# EAGLE design Filter-PCB (EAGLE 7.7.0)
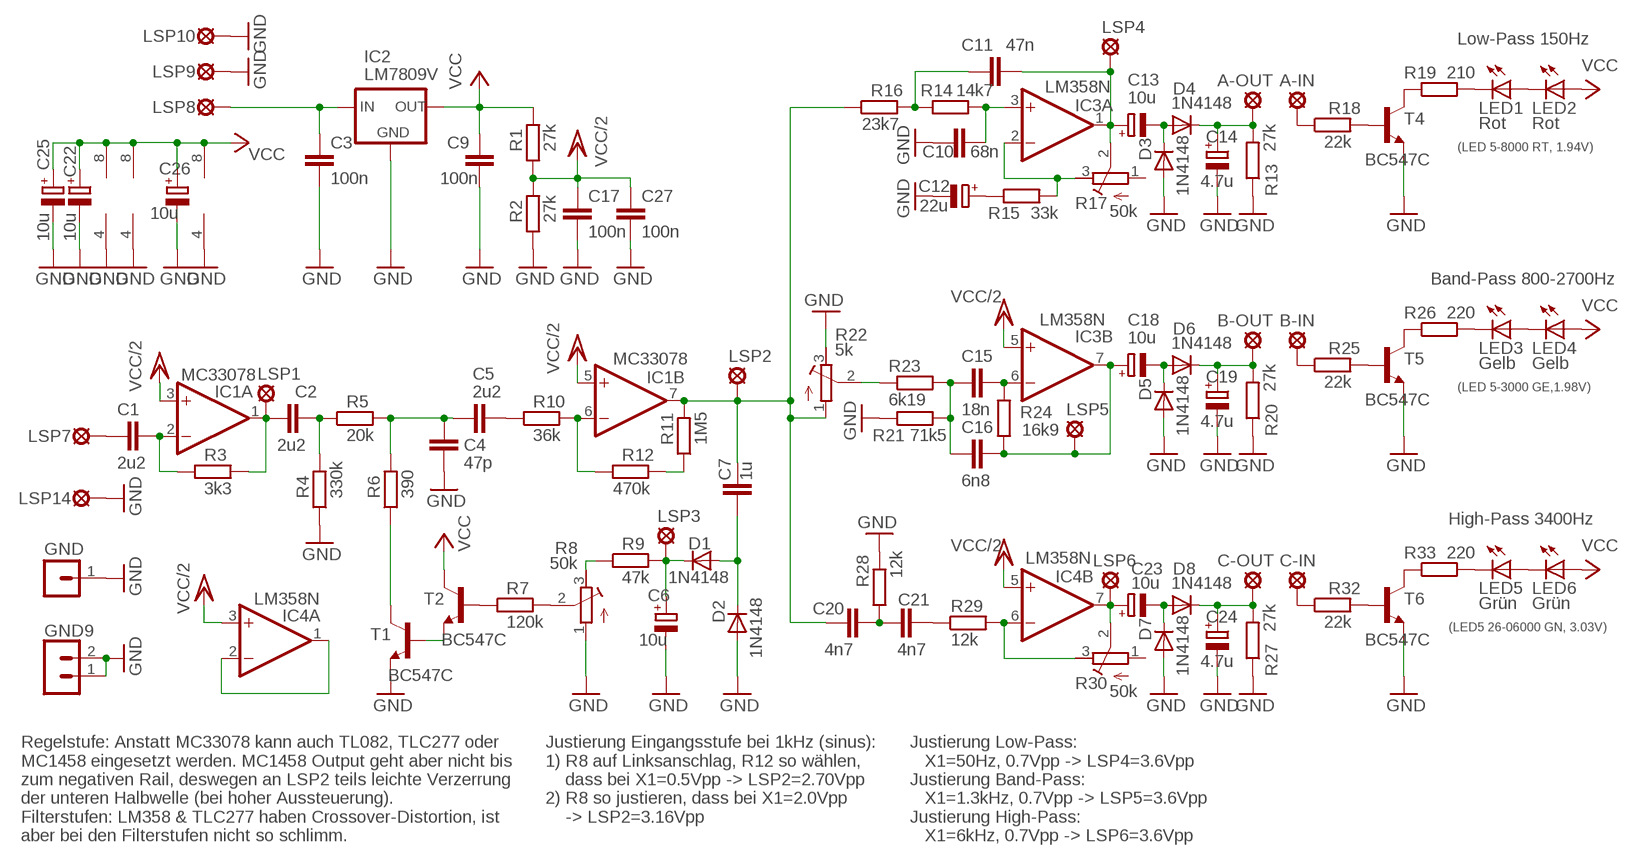
[diagram p0: schematic, sheet 1]

## Parts
A-IN  LSP13  [LSP13]
A-OUT  LSP13  [LSP13]
B-IN  LSP13  [LSP13]
B-OUT  LSP13  [LSP13]
C1  2u2  C-EUC1206  [C1206]
C2  2u2  C-EUC1206  [C1206]
C3  100n  C-EU050-024X044  [C050-024X044]
C4  47p  C-EUC1206  [C1206]
C5  2u2  C-EUC1206  [C1206]
C6  10u  CPOL-EUTT2D4  [TT2D4]
C7  1u  C-EU050-024X044  [C050-024X044]
C9  100n  C-EUC1206  [C1206]
C10  68n  C-EUC1206  [C1206]
C11  47n  C-EUC1206  [C1206]
C12  22u  CPOL-EUTT2D4  [TT2D4]
C13  10u  CPOL-EUTT2D4  [TT2D4]
C14  4.7u  CPOL-EUTT2D4  [TT2D4]
C15  18n  C-EUC1206  [C1206]
C16  6n8  C-EUC1206  [C1206]
C17  100n  C-EU050-024X044  [C050-024X044]
C18  10u  CPOL-EUTT2D4  [TT2D4]
C19  4.7u  CPOL-EUTT2D4  [TT2D4]
C20  4n7  C-EU050-024X044  [C050-024X044]
C21  4n7  C-EU050-024X044  [C050-024X044]
C22  10u  CPOL-EUTT2D4  [TT2D4]
C23  10u  CPOL-EUTT2D4  [TT2D4]
C24  4.7u  CPOL-EUTT2D4  [TT2D4]
C25  10u  CPOL-EUTT2D4  [TT2D4]
C26  10u  CPOL-EUTT2D4  [TT2D4]
C27  100n  C-EUC1206  [C1206]
C-IN  LSP13  [LSP13]
C-OUT  LSP13  [LSP13]
D1  1N4148  DIODE-SOD80C  [SOD80C]
D2  1N4148  DIODE-SOD80C  [SOD80C]
D3  1N4148  DIODE-SOD80C  [SOD80C]
D4  1N4148  DIODE-SOD80C  [SOD80C]
D5  1N4148  DIODE-SOD80C  [SOD80C]
D6  1N4148  DIODE-SOD80C  [SOD80C]
D7  1N4148  DIODE-SOD80C  [SOD80C]
D8  1N4148  DIODE-SOD80C  [SOD80C]
GND  MA01-1  [MA01-1]
GND9  MA02-1  [MA02-1]
IC1  MC33078  LM358N  [DIL08]
IC2  LM7809V  78XXS  [78XXS]
IC3  LM358N  [DIL08]
IC4  LM358N  [DIL08]
LED1  Rot  LED5MM  [LED5MM]
LED2  Rot  LED5MM  [LED5MM]
LED3  Gelb  LED5MM  [LED5MM]
LED4  Gelb  LED5MM  [LED5MM]
LED5  Grün  LED5MM  [LED5MM]
LED6  Grün  LED5MM  [LED5MM]
LSP1  LSP11  [LSP11]
LSP2  LSP11  [LSP11]
LSP3  LSP11  [LSP11]
LSP4  LSP11  [LSP11]
LSP5  LSP11  [LSP11]
LSP6  LSP11  [LSP11]
LSP7  LSP13  [LSP13]
LSP8  LSP13  [LSP13]
LSP9  LSP13  [LSP13]
LSP10  LSP13  [LSP13]
LSP14  LSP13  [LSP13]
R1  27k  R-EU_M1206  [M1206]
R2  27k  R-EU_M1206  [M1206]
R3  3k3  R-EU_M1206  [M1206]
R4  330k  R-EU_M1206  [M1206]
R5  20k  R-EU_M1206  [M1206]
R6  390  R-EU_M1206  [M1206]
R7  120k  R-EU_M1206  [M1206]
R8  50k  R-TRIMM64P  [RTRIM64P]
R9  47k  R-EU_M1206  [M1206]
R10  36k  R-EU_M1206  [M1206]
R11  1M5  R-EU_M1206  [M1206]
R12  470k  R-EU_0207/10  [0207/10]
R13  27k  R-EU_0207/10  [0207/10]
R14  14k7  R-EU_0207/10  [0207/10]
R15  33k  R-EU_M1206  [M1206]
R16  23k7  R-EU_0207/10  [0207/10]
R17  50k  R-TRIMM64P  [RTRIM64P]
R18  22k  R-EU_M1206  [M1206]
R19  210  R-EU_0207/10  [0207/10]
R20  27k  R-EU_0207/10  [0207/10]
R21  71k5  R-EU_0207/10  [0207/10]
R22  5k  R-TRIMM64P  [RTRIM64P]
R23  6k19  R-EU_0207/10  [0207/10]
R24  16k9  R-EU_0207/10  [0207/10]
R25  22k  R-EU_M1206  [M1206]
R26  220  R-EU_0207/10  [0207/10]
R27  27k  R-EU_0207/10  [0207/10]
R28  12k  R-EU_0207/10  [0207/10]
R29  12k  R-EU_0207/10  [0207/10]
R30  50k  R-TRIMM64P  [RTRIM64P]
R32  22k  R-EU_M1206  [M1206]
R33  220  R-EU_0207/10  [0207/10]
T1  BC547C  BC547  [TO92]
T2  BC547C  BC547  [TO92]
T4  BC547C  BC547  [TO92]
T5  BC547C  BC547  [TO92]
T6  BC547C  BC547  [TO92]

## Nets
GND: C3.2 C4.2 C6.- C9.1 C10.1 C12.- C14.- C17.2 C19.- C22.- C24.- C25.- C26.- C27.2 D2.A D3.A D5.A D7.A GND9.1 GND9.2 GND.1 IC1.4(P:V-) IC2.GND IC3.4(P:V-) IC4.4(P:V-) LSP9.MP LSP10.MP LSP14.MP R2.1 R4.1 R8.1(A) R13.1 R20.1 R21.1 R22.3(E) R27.1 R28.2 T1.1(E) T4.1(E) T5.1(E) T6.1(E)
N$1: R18.2 T4.2(B)
N$2: R25.2 T5.2(B)
N$3: R32.2 T6.2(B)
N$4: C1.2 IC1.2(A:-IN) R3.1
N$5: C2.2 R4.2 R5.1
N$6: R6.1 T1.3(C)
N$7: C2.1 IC1.1(A:OUT) LSP1.MP R3.2
N$8: C4.1 C5.1 R5.2 R6.2
N$9: R7.1 T2.2(B)
N$10: R7.2 R8.2(S)
N$11: T1.2(B) T2.1(E)
N$12: R8.3(E) R9.1
N$13: IC1.6(B:-IN) R10.2 R12.1
N$14: C7.1 C20.1 IC1.7(B:OUT) LSP2.MP R11.2 R16.1 R22.1(A)
N$15: C6.+ D1.C LSP3.MP R9.2
N$16: C7.2 D1.A D2.C
N$17 [Stromversorgung]: C3.1 IC2.IN LSP8.MP
N$18: C11.1 R14.1 R16.2
N$19: C5.2 R10.1
N$20: R11.1 R12.2
N$21: C10.2 IC3.3(A:+IN) R14.2
N$22: IC3.2(A:-IN) R15.2 R17.3(E)
N$23: C11.2 C13.+ IC3.1(A:OUT) LSP4.MP R17.2(S)
N$24: C12.+ R15.1
N$25: R22.2(S) R23.1
N$26: C13.- D3.C D4.A
N$27: A-OUT.MP C14.+ D4.C R13.2
N$28: C1.1 LSP7.MP
N$29: R19.1 T4.3(C)
N$30: LED1.K(C) R19.2
N$31: C24.+ C-OUT.MP D8.C R27.2
N$32: C15.1 C16.1 R21.2 R23.2
N$33: C15.2 IC3.6(B:-IN) R24.2
N$34: C21.2 R29.1
N$35: C16.2 C18.+ IC3.7(B:OUT) LSP5.MP R24.1
N$36: C20.2 C21.1 R28.1
N$37: C18.- D5.C D6.A
N$38: B-OUT.MP C19.+ D6.C R20.2
N$39: A-IN.MP R18.1
N$40: R26.1 T5.3(C)
N$41: LED3.K(C) R26.2
N$42: B-IN.MP R25.1
N$43: C23.+ IC4.7(B:OUT) LSP6.MP R30.2(S)
N$44: C-IN.MP R32.1
N$45: IC4.6(B:-IN) R29.2 R30.3(E)
N$46: C23.- D7.C D8.A
N$47: LED5.A LED6.K(C)
N$48: LED3.A LED4.K(C)
N$49: R33.1 T6.3(C)
N$50: LED5.K(C) R33.2
N$51: LED1.A LED2.K(C)
N$54: IC4.1(A:OUT) IC4.2(A:-IN)
VCC [Stromversorgung]: C9.2 C22.+ C25.+ C26.+ IC1.8(P:V+) IC2.OUT IC3.8(P:V+) IC4.8(P:V+) LED2.A LED4.A LED6.A R1.2 T2.3(C)
VCC/2: C17.1 C27.1 IC1.3(A:+IN) IC1.5(B:+IN) IC3.5(B:+IN) IC4.3(A:+IN) IC4.5(B:+IN) R1.1 R2.2
Unconnected: R17.1(A) R30.1(A)

## Notes on the sheet
- Low-Pass 150Hz
- (LED 5-8000 RT, 1.94V)
- Band-Pass 800-2700Hz
- (LED 5-3000 GE,1.98V)
- High-Pass 3400Hz
- (LED5 26-06000 GN, 3.03V)
- Regelstufe: Anstatt MC33078 kann auch TL082, TLC277 oder
  MC1458 eingesetzt werden. MC1458 Output geht aber nicht bis
  zum negativen Rail, deswegen an LSP2 teils leichte Verzerrung
  der unteren Halbwelle (bei hoher Aussteuerung).
  Filterstufen: LM358 & TLC277 haben Crossover-Distortion, ist
  aber bei den Filterstufen nicht so schlimm.
- Justierung Eingangsstufe bei 1kHz (sinus):
  1) R8 auf Linksanschlag, R12 so wählen,
      dass bei X1=0.5Vpp -> LSP2=2.70Vpp
  2) R8 so justieren, dass bei X1=2.0Vpp
      -> LSP2=3.16Vpp
- Justierung Low-Pass: 
     X1=50Hz, 0.7Vpp -> LSP4=3.6Vpp
  Justierung Band-Pass: 
     X1=1.3kHz, 0.7Vpp -> LSP5=3.6Vpp
  Justierung High-Pass: 
     X1=6kHz, 0.7Vpp -> LSP6=3.6Vpp

## Library data of the parts
A-IN A-OUT B-IN B-OUT C-IN C-OUT LSP7-LSP10 LSP14 = solpad:LSP13: SOLDER PAD drill 1.3 mm, distributor Buerklin, 12H562
C1-C5 C7 C9-C11 C15-C17 C20 C21 C27 = rcl:C-EU: CAPACITOR, European symbol
C6 C12-C14 C18 C19 C22-C26 = rcl:CPOL-EU: POLARIZED CAPACITOR, European symbol
D1-D8 = diode:DIODE-: DIODE
GND = tj-library:MA01-1: PIN HEADER
GND9 = tj-library:MA02-1: PIN HEADER
IC1 IC3 IC4 = linear:LM358: OP AMP also LM158; LM258; LM2904 Source: http://cache.national.com/ds/LM/LM158.pdf
IC2 = v-reg:78XXS: VOLTAGE REGULATOR
LED1-LED6 = led:LED: LED OSRAM: - CHIPLED LG R971, LG N971, LY N971, LG Q971, LY Q971, LO R971, LY R971 LH N974, LH R974 LS Q976, LO Q976, LY Q976 LO Q996 - Hyper CHIPLED LW Q18S LB Q993, LB Q99A, LB R99A - SideLED LS A670, LO A670, LY A670, LG A670, LP A670 LB A673, LV A673, LT A673, LW A673 LH A674 LY A675 LS A676, LA A676, LO A676, LY A676, LW A676 LS A679, LY A679, LG A679 - Hyper Micro SIDELED® LS Y876, LA Y876, LO Y876, LY Y876 LT Y87S - SmartLED LW L88C, LW L88S LB L89C, LB L89S, LG L890 LS L89K, LO L89K, LY L89K LS L896, LA L896, LO L896, LY L896 - TOPLED LS T670, LO T670, LY T670, LG T670, LP T670 LSG T670, LSP T670, LSY T670, LOP T670, LYG T670 LG T671, LOG T671, LSG T671 LB T673, LV T673, LT T673, LW T673 LH T674 LS T676, LA T676, LO T676, LY T676, LB T676, LH T676, LSB T676, LW T676 LB T67C, LV T67C, LT T67C, LS T67K, LO T67K, LY T67K, LW E67C LS E67B, LA E67B, LO E67B, LY E67B, LB E67C, LV E67C, LT E67C LW T67C LS T679, LY T679, LG T679 LS T770, LO T770, LY T770, LG T770, LP T770 LB T773, LV T773, LT T773, LW T773 LH T774 LS E675, LA E675, LY E675, LS T675 LS T776, LA T776, LO T776, LY T776, LB T776 LHGB T686 LT T68C, LB T68C - Hyper Mini TOPLED® LB M676 - Mini TOPLED Santana® LG M470 LS M47K, LO M47K, LY M47K Source: http://www.osram.convergy.de LUXEON: - LUMILED® LXK2-PW12-R00, LXK2-PW12-S00, LXK2-PW14-U00, LXK2-PW14-V00 LXK2-PM12-R00, LXK2-PM12-S00, LXK2-PM14-U00 LXK2-PE12-Q00, LXK2-PE12-R00, LXK2-PE12-S00, LXK2-PE14-T00, LXK2-PE14-U00 LXK2-PB12-K00, LXK2-PB12-L00, LXK2-PB12-M00, LXK2-PB14-N00, LXK2-PB14-P00, LXK2-PB14-Q00 LXK2-PR12-L00, LXK2-PR12-M00, LXK2-PR14-Q00, LXK2-PR14-R00 LXK2-PD12-Q00, LXK2-PD12-R00, LXK2-PD12-S00 LXK2-PH12-R00, LXK2-PH12-S00 LXK2-PL12-P00, LXK2-PL12-Q00, LXK2-PL12-R00 Source: www.luxeon.com KINGBRIGHT: KA-3528ASYC Source: www.kingbright.com
LSP1-LSP6 = solpad:LSP11: SOLDER PAD drill 1.1 mm
R1-R7 R9-R16 R18-R21 R23-R29 R32 R33 = rcl:R-EU_: RESISTOR, European symbol
R8 R17 R22 R30 = rcl:R-TRIMM: Trimm resistor
T1 T2 T4-T6 = transistor:BC547: NPN TRANSISTOR

## Net classes
0 default: width 0.406 mm, clearance 0.61 mm
1 Stromversorgung: width 0.813 mm, clearance 0.813 mm

## Board
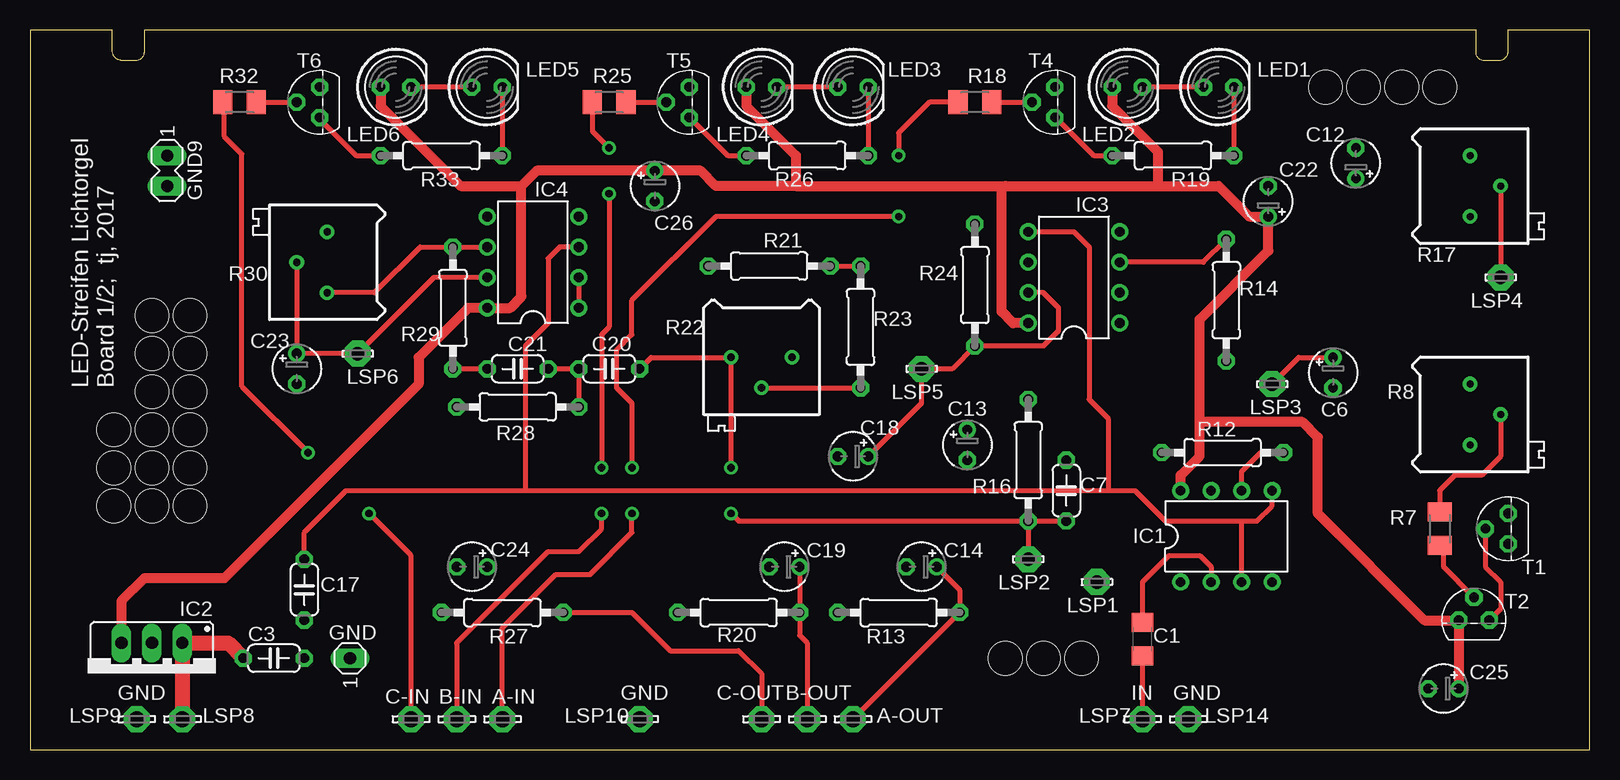
[diagram p1: board, top side]
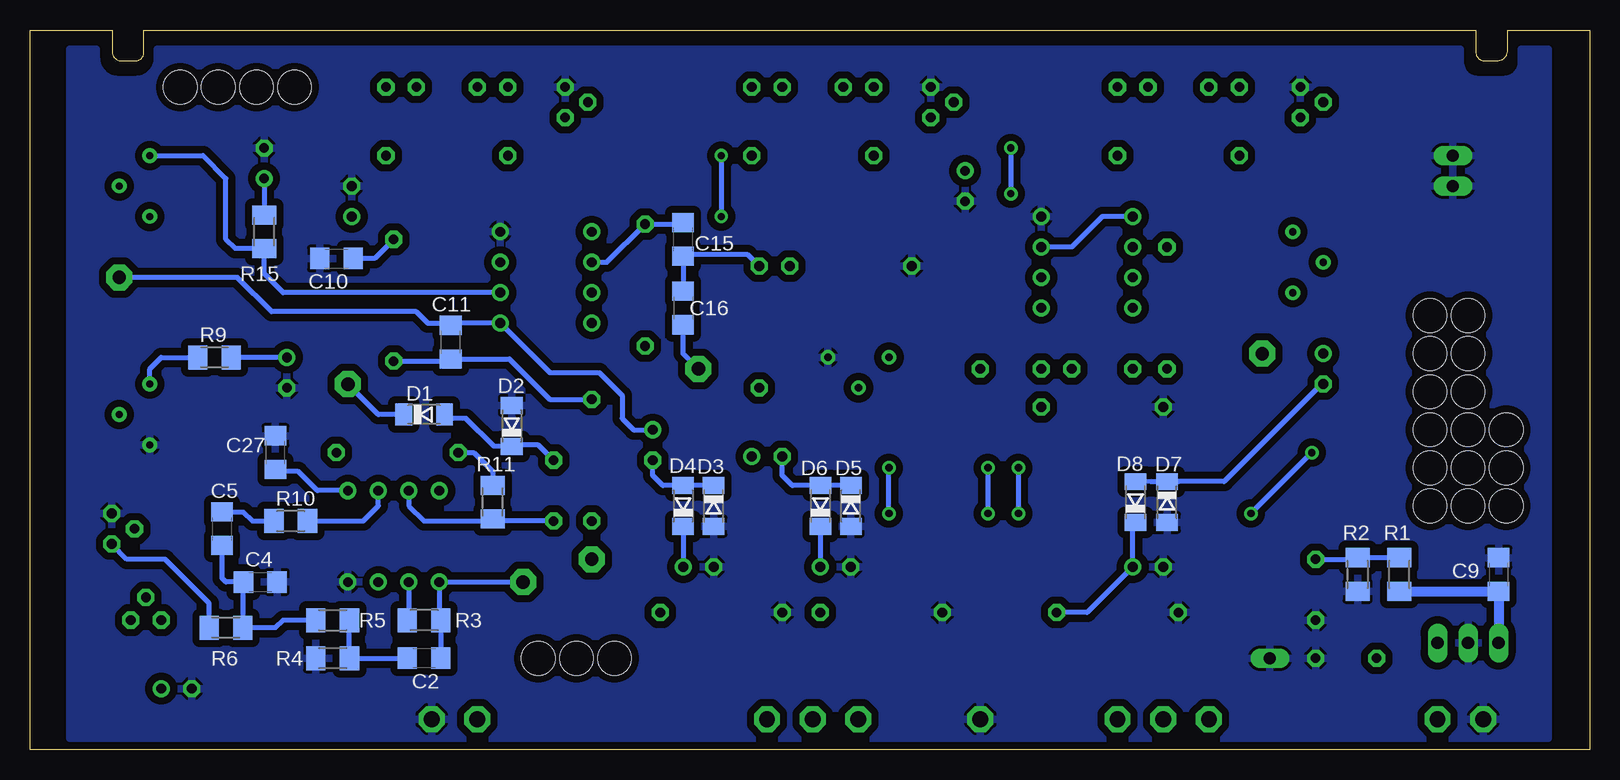
[diagram p2: board, bottom side, seen from below]

Size 130 x 60.01 mm. Coordinates in mm from the lower left corner, seen from the top.
Outline: 0,0 130,0 130,60.01 123.14,60.01 123.14,58.14 arc-90 122.44,57.45 121.17,57.45 arc-90 120.5,58.12 120.5,60 9.5,60 9.5,58.12 arc-90 8.83,57.45 7.7,57.45 arc-90 6.87,58.28 6.87,60.01 0,60.01 0,0
Copper layers (1*16): Top 0.035mm / dielectric 1.5mm / Bottom 0.035mm
Design rules "default *": minimum track width 10mil, minimum drill 24mil, track to track 8mil, track to pad 8mil, pad to pad 8mil, via to via 8mil, smd to smd 8mil, copper to edge 16mil, drill to drill 8mil, minimum pad ring 12mil, minimum via ring 10mil, stop-mask expansion 4mil, vias tented up to drill 0mil, thermal gap 10mil
Holes 2.8 mm at 6.99,20.32 10.16,20.32 13.34,20.32 10.16,23.5 6.99,23.5 13.34,23.5 6.99,26.67 10.16,26.67 13.34,26.67 10.16,29.84 13.34,29.84 10.16,33.02 117.47,55.24 114.3,55.24 111.12,55.24 107.95,55.24 10.16,36.2 81.28,7.62 84.45,7.62 87.63,7.62 13.34,33.02 13.34,36.2

### Footprints (pad centres in the part's own frame; a part is rotated, then mirrored left to right if it is on the bottom)
LSP13 = drill 1.321 pad 2.159 octagon: MP 0,0
C1206 = smd 1.6 x 1.8: 1 -1.4,0; 2 1.4,0
C050-024X044 = drill 0.813 octagon: 1 -2.54,0; 2 2.54,0
TT2D4 = drill 0.813: + -1.27,0 | drill 0.813 octagon: - 1.27,0
SOD80C = smd 1.4 x 1.8: A 1.7,0; C -1.7,0
MA01-1 = drill 1.016 long: 1 0,0
MA02-1 = drill 1.016 long: 1 -1.27,0; 2 1.27,0
DIL08 = drill 0.813 pad 1.27: 1 -3.81,-3.81; 2 -1.27,-3.81; 3 1.27,-3.81; 4 3.81,-3.81; 5 3.81,3.81; 6 1.27,3.81; 7 -1.27,3.81; 8 -3.81,3.81
78XXS = drill 1.016 long: GND 0,-2.54; IN -2.54,-2.54; OUT 2.54,-2.54
LED5MM = drill 0.813 octagon: A -1.27,0; K 1.27,0
LSP11 = drill 1.118 pad 2.159 octagon: MP 0,0
M1206 = smd 1.6 x 2: 1 -1.4,0; 2 1.4,0
RTRIM64P = drill 0.61: 1 0,-2.54; 2 2.54,0; 3 0,2.54
0207/10 = drill 0.813 octagon: 1 -5.08,0; 2 5.08,0
TO92 = drill 0.813 octagon: 1 1.27,0; 2 0,1.905; 3 -1.27,0

### Placement (x,y rotation side)
A-IN  39.37,2.54 0 top
A-OUT  68.58,2.54 0 top
B-IN  35.56,2.54 0 top
B-OUT  64.77,2.54 0 top
C1  92.71,9.21 90 top
C2  97.16,7.62 180 bottom
C3  20.32,7.62 0 top
C4  110.81,13.97 0 bottom
C5  113.98,18.41 90 bottom
C6  108.58,31.43 270 top
C7  86.36,21.59 90 top
C9  7.62,14.61 270 bottom
C10  104.46,40.96 0 bottom
C11  94.93,33.97 90 bottom
C12  110.49,48.9 90 top
C13  78.11,25.4 270 top
C14  74.3,15.24 180 top
C15  75.56,42.55 90 bottom
C16  75.56,36.83 270 bottom
C17  22.86,13.34 270 top
C18  68.58,24.45 180 top
C19  62.87,15.24 180 top
C20  48.26,31.75 180 top
C21  40.64,31.75 180 top
C22  103.19,45.72 90 top
C23  22.23,31.75 270 top
C24  36.83,15.24 180 top
C25  117.79,5.08 180 top
C26  52.07,46.99 270 top
C27  109.54,24.77 90 bottom
C-IN  31.75,2.54 0 top
C-OUT  60.96,2.54 0 top
D1  97.16,27.94 0 bottom
D2  89.85,26.99 90 bottom
D3  73.03,20.32 270 bottom
D4  75.56,20.32 90 bottom
D5  61.59,20.32 270 bottom
D6  64.14,20.32 90 bottom
D7  35.24,20.64 270 bottom
D8  37.88,20.64 90 bottom
GND  26.67,7.62 90 top
GND9  11.43,48.26 270 top
IC1  99.69,17.78 0 top
IC2  10.16,6.35 180 top
IC3  87,39.37 90 top
IC4  41.91,40.64 90 top
LED1  99.06,55.24 0 top
LED2  91.44,55.24 0 top
LED3  68.58,55.24 0 top
LED4  60.96,55.24 0 top
LED5  38.1,55.24 0 top
LED6  30.48,55.24 0 top
LSP1  88.9,13.97 0 top
LSP2  83.19,15.88 0 top
LSP3  103.5,30.48 0 top
LSP4  122.56,39.37 0 top
LSP5  74.3,31.75 0 top
LSP6  27.3,33.02 0 top
LSP7  92.71,2.54 0 top
LSP8  12.7,2.54 0 top
LSP9  8.89,2.54 0 top
LSP10  50.8,2.54 0 top
LSP14  96.52,2.54 0 top
R1  15.88,14.61 270 bottom
R2  19.37,14.61 90 bottom
R3  97.16,10.79 0 bottom
R4  104.78,7.62 0 bottom
R5  104.78,10.79 180 bottom
R6  113.67,10.16 0 bottom
R7  117.47,18.41 90 top
R8  120.02,27.94 0 top
R9  114.62,32.7 0 bottom
R10  108.27,19.05 0 bottom
R11  91.44,20.64 270 bottom
R12  99.38,24.77 180 top
R13  72.39,11.43 0 top
R14  99.69,37.47 90 top
R15  110.49,43.18 270 bottom
R16  83.19,24.13 90 top
R17  120.02,46.99 0 top
R18  78.74,53.98 0 top
R19  95.25,49.53 0 top
R20  59.05,11.43 0 top
R21  61.59,40.32 0 top
R22  60.96,32.7 270 top
R23  69.22,35.24 90 top
R24  78.74,38.73 90 top
R25  48.26,53.98 0 top
R26  64.77,49.53 0 top
R27  39.37,11.43 0 top
R28  40.64,28.57 180 top
R29  35.24,36.83 90 top
R30  24.77,40.64 180 top
R32  17.46,53.98 0 top
R33  34.29,49.53 0 top
T1  123.19,18.41 90 top
T2  120.33,10.79 0 top
T4  85.41,53.98 90 top
T5  54.93,53.98 90 top
T6  24.13,53.98 90 top

### Tracks (layer width: path | path; a pad name or v marks a point on that pad's centre or on a via)
GND
  pour Bottom (isolate 0.61): 3.49,0.95 126.68,0.95 126.68,58.42 124.46,58.42 124.46,57.68 arc-90 122.66,55.88 121.18,55.88 arc-90 119.38,57.68 119.38,58.42 10.79,58.42 10.79,57.3 arc-90 9.38,55.88 7.13,55.88 arc-90 5.71,57.3 5.71,58.42 3.49,58.42
N$1
  Top 0.406: R18.2 T4.2
N$2
  Top 0.406: R25.2 T5.2
N$3
  Top 0.406: R32.2 T6.2
N$4
  Top 0.406: C1.2 92.71,13.97 94.93,16.19 97.47,16.19 98.42,15.24 IC1.2
  Bottom 0.406: IC1.2 98.42,10.93 R3.1
N$5
  Bottom 0.406: C2.2 R4.2 103.38,10.67 R5.1
N$6
  Bottom 0.406: R6.1 115.06,12.2 118.75,15.88 121.92,15.88 T1.3
N$7
  Bottom 0.406: LSP1.MP IC1.1 95.89,10.93 R3.2 C2.1
N$8
  Bottom 0.406: R5.2 108.9,10.79 109.54,10.16 R6.2 112.21,10.16 C4.1 113.67,13.97 113.98,14.29 C5.1 113.98,16.7
N$9
  Top 0.406: T2.2 117.79,15.24 117.79,16.7 R7.1
N$10
  Top 0.406: R8.2 122.56,24.45 120.97,22.86 118.75,22.86 117.47,21.59 R7.2
N$11
  Top 0.406: T1.2 121.28,15.24 122.56,13.97 122.56,11.75 T2.1
N$12
  Bottom 0.406: R8.3 120.02,31.75 119.06,32.7 R9.1
N$13
  Top 0.406: IC1.6 100.97,23.18 102.55,24.77 R12.1
  Bottom 0.406: R10.2 102.23,19.05 100.97,20.32 IC1.6
N$14  (via drill 0.61)
  Top 0.406: C20.1 51.75,32.7 R22.1 v58.42,23.5 | R16.1 C7.1 | R16.1 LSP2.MP | v58.42,19.68 59.05,19.05 R16.1
  Bottom 0.406: v58.42,19.68 v58.42,23.5 | C7.1 91.25,19.05 R11.2 91.63,19.05 97.16,19.05 98.42,20.32 IC1.7
N$15
  Top 0.406: LSP3.MP 105.73,32.7 C6.+
  Bottom 0.406: C6.+ R9.2 | D1.C 100.97,27.94 LSP3.MP
N$16
  Bottom 0.406: C7.2 87.63,25.4 89.74,25.4 D2.C 91.33,25.29 93.66,27.62 95.14,27.62 D1.A
N$17
  Top 1.27: LSP8.MP IC2.IN 16.51,8.89 C3.1
N$18
  Bottom 0.406: R14.1 95.12,32.38 C11.1 90.04,32.57 86.68,29.21 R16.2
N$19
  Bottom 0.406: C5.2 112.21,19.82 111.44,19.05 R10.1
N$20
  Bottom 0.406: R12.2 93.03,24.77 91.44,23.18 R11.1
N$21
  Top 0.406: IC3.3 97.79,40.64 R14.2
  Bottom 0.406: R14.2 101.28,40.96 C10.2
N$22
  Bottom 0.406: R17.3 115.57,49.53 113.67,47.62 113.67,42.55 112.9,41.78 R15.2 110.49,39.69 108.9,38.1 IC3.2
N$23
  Top 0.406: R17.2 LSP4.MP
  Bottom 0.406: LSP4.MP 112.71,39.37 109.86,36.51 97.79,36.51 96.84,35.56 95.12,35.56 C11.2 94.75,35.56 IC3.1 86.68,31.43 82.55,31.43 80.64,29.53 80.64,27.62 79.69,26.67 C13.+
N$24
  Bottom 0.406: C12.+ R15.1
N$25
  Top 0.406: R22.2 R23.1
N$26
  Bottom 0.406: D3.C D4.A 77.27,22.02 78.11,22.86 C13.-
N$27
  Top 0.406: A-OUT.MP R13.2 77.47,13.34 C14.+
  Bottom 0.406: D4.C C14.+
N$28
  Top 0.406: LSP7.MP C1.1
N$29
  Top 0.406: R19.1 88.65,49.53 85.6,52.58 T4.3
N$30
  Top 0.406: LED1.K R19.2
N$31
  Top 0.406: R27.2 50.16,11.43 53.34,8.26 59.05,8.26 60.96,6.35 C-OUT.MP
  Bottom 0.406: D8.C 38.1,18.71 C24.+ 41.91,11.43 R27.2
N$32
  Top 0.406: R21.2 R23.2
  Bottom 0.406: R23.2 70.17,41.27 75.44,41.27 C15.1 C16.1
N$33
  Bottom 0.406: IC3.6 81.92,40.64 R24.2 75.69,43.81 C15.2
N$34
  Top 0.406: C21.2 R29.1
N$35
  Top 0.406: IC3.7 84.45,38.1 85.72,36.83 85.72,34.92 84.45,33.66 R24.1 76.83,31.75 LSP5.MP 74.3,28.89 C18.+
  Bottom 0.406: LSP5.MP 75.56,33.02 C16.2
N$36
  Top 0.406: R28.1 C20.2 C21.1
N$37
  Bottom 0.406: D5.C D6.A 66.47,22.02 67.31,22.86 C18.-
N$38
  Top 0.406: C19.+ R20.2 64.14,9.53 64.77,8.89 B-OUT.MP
  Bottom 0.406: D6.C C19.+
N$39  (via drill 0.61)
  Top 0.406: R18.1 74.93,53.98 72.39,51.44 v72.39,49.53 | v72.39,44.45 57.15,44.45 50.16,37.47 50.16,34.61 48.9,33.34 48.9,30.16 50.16,28.89 v50.16,23.5 | A-IN.MP 39.37,10.16 43.81,14.61 46.67,14.61 50.16,18.1 v50.16,19.68
  Bottom 0.406: v72.39,49.53 v72.39,44.45 | v50.16,23.5 v50.16,19.68
N$40
  Top 0.406: R26.1 58.17,49.53 55.12,52.58 T5.3
N$41
  Top 0.406: LED3.K R26.2
N$42  (via drill 0.61)
  Top 0.406: R25.1 46.86,51.56 v48.26,50.16 | B-IN.MP 35.56,8.89 43.18,16.51 45.72,16.51 47.62,18.41 v47.62,19.68 | v48.26,46.35 48.26,35.24 47.62,34.61 v47.62,23.5
  Bottom 0.406: v48.26,50.16 v48.26,46.35 | v47.62,23.5 v47.62,19.68
N$43
  Top 0.406: IC4.7 33.66,39.37 LSP6.MP C23.+ R30.2
N$44  (via drill 0.61)
  Top 0.406: v23.18,24.77 17.65,30.29 17.65,49.66 16.19,51.12 16.19,53.84 R32.1 | v28.26,19.68 31.75,16.19 C-IN.MP
  Bottom 0.406: v23.18,24.77 v28.26,19.68
N$45
  Top 0.406: R30.3 28.7,38.1 32.51,41.91 R29.2 IC4.6
N$46
  Bottom 0.406: 34.29,22.35 36.58,22.35 D8.A | 34.29,22.35 30.48,22.35 22.35,30.48 C23.- | 34.29,22.35 D7.C
N$47
  Top 0.406: LED5.A LED6.K
N$48
  Top 0.406: LED3.A LED4.K
N$49
  Top 0.406: R33.1 27.18,49.53 24.13,52.58 T6.3
N$50
  Top 0.406: LED5.K R33.2
N$51
  Top 0.406: LED1.A LED2.K
N$54
  Top 0.406: IC4.2 IC4.1
VCC
  Top 0.813: IC1.8 95.89,22.86 97.47,24.45 97.47,27.3 | 97.47,27.3 97.47,35.88 103.19,41.59 C22.+ 101.6,44.45 99.06,46.99 93.98,46.99 | 97.47,27.3 106.05,27.3 107.31,26.04 107.31,19.68 116.2,10.79 T2.3 C25.+ | LED2.A 90.17,53.66 93.98,49.85 93.98,46.99 | LED4.A 59.69,53.66 63.82,49.53 63.82,46.99 | 63.82,46.99 81.28,46.99 | 81.28,46.99 93.98,46.99 | LED6.A 29.21,53.66 35.88,46.99 40.96,46.99 | 40.96,46.99 40.96,37.78 40.01,36.83 IC4.8 36.51,36.83 32.38,32.7 32.38,30.48 16.19,14.29 9.53,14.29 7.62,12.38 IC2.OUT | IC3.8 81.92,35.56 80.96,36.51 80.96,46.67 81.28,46.99 | 63.82,46.99 57.15,46.99 55.88,48.26 C26.+ 42.23,48.26 40.96,46.99
  Bottom 0.813: R1.2 C9.2 IC2.OUT
VCC/2
  Top 0.406: 41.27,21.59 26.35,21.59 22.86,18.1 C17.1 | 41.27,21.59 89.85,21.59 | IC3.5 87,43.18 88.27,41.91 88.27,29.21 89.85,27.62 89.85,21.59 | IC4.3 44.13,41.91 43.18,40.96 43.18,35.56 41.27,33.66 41.27,21.59 | 89.85,21.59 92.08,21.59 94.61,19.05 100.97,19.05 | 100.97,19.05 102.23,19.05 103.5,20.32 IC1.5 | IC1.3 100.97,19.05
  Bottom 0.406: IC1.5 106.05,21.59 107.63,23.18 109.35,23.18 C27.1 | 19.24,15.88 R2.2 | IC4.5 40.64,44.45 43.18,41.91 IC4.3 | R1.1 R2.2 | C17.1 19.5,15.88 R2.2

### Text on the board
tPlace: LED-Streifen Lichtorgel / Board 1/2; tj, 2017 | GND | GND | IN | GND